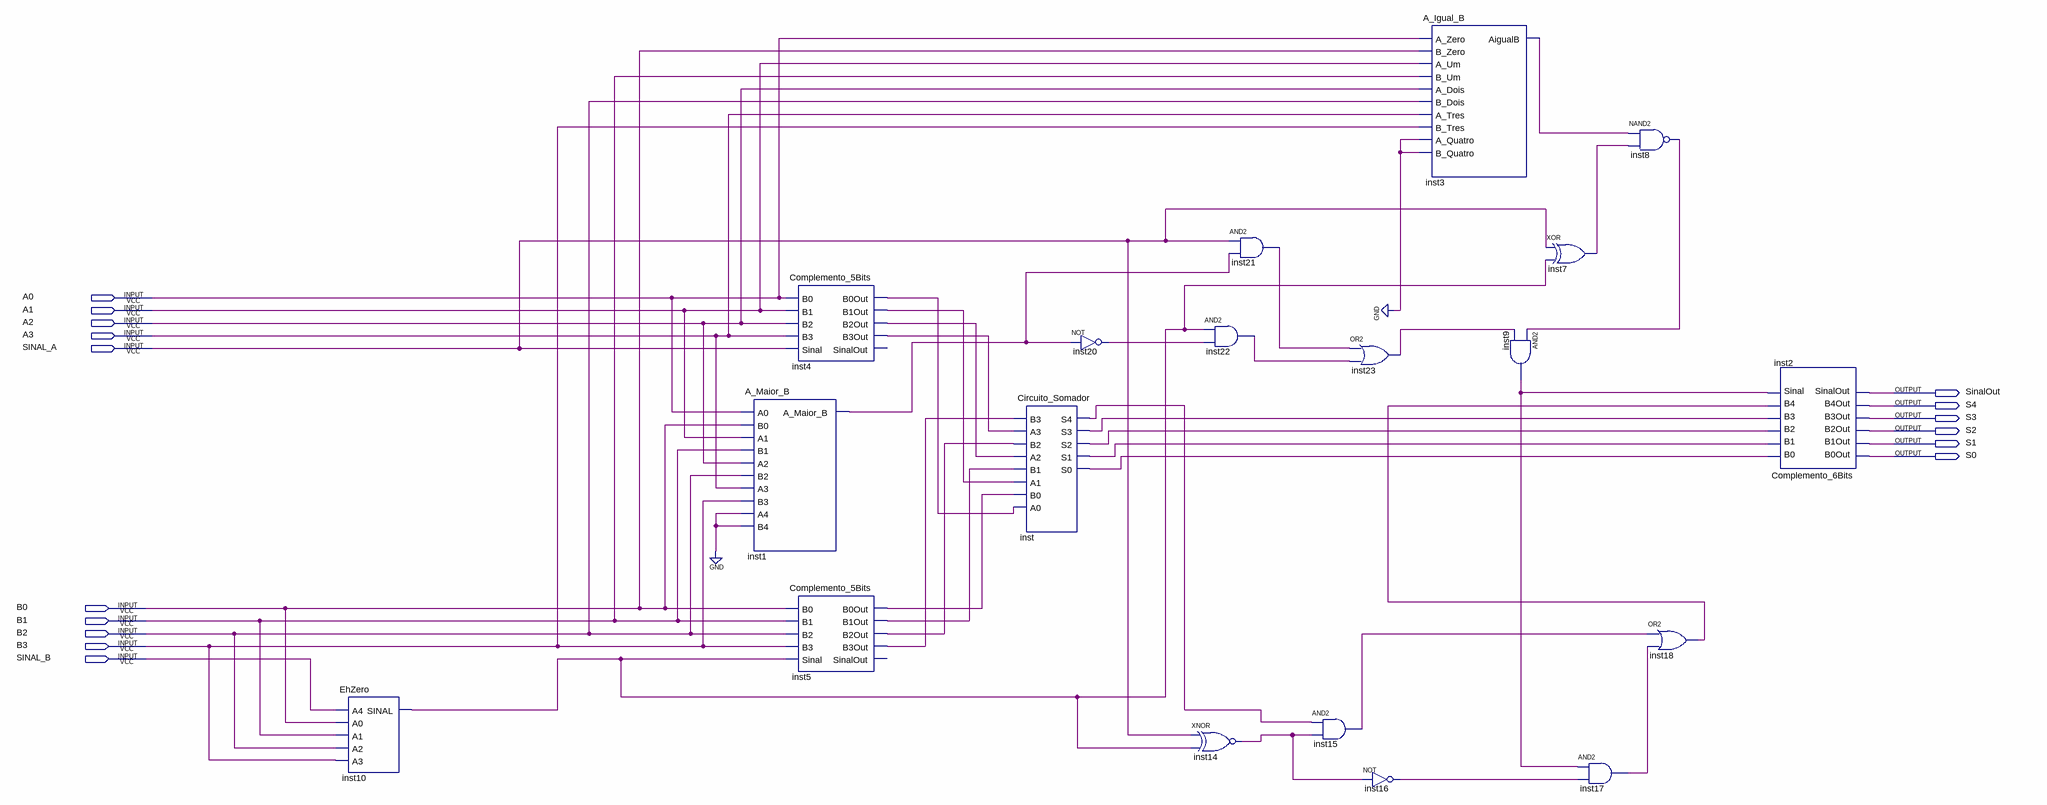
[diagram p0: schematic sheet]
// Quartus schematic A_Soma_B.bdf as structural Verilog: 19 symbols, 16 pins
module A_Soma_B (
  input  A0,
  input  A1,
  input  A2,
  input  A3,
  input  SINAL_A,
  input  B0,
  input  B1,
  input  B2,
  input  B3,
  input  SINAL_B,
  output SinalOut,
  output S4,
  output S3,
  output S2,
  output S1,
  output S0
);

  wire inst1_a_maior_b, inst3_aigualb, inst4_b0out, inst4_b1out, inst4_b2out, inst4_b3out, inst5_b0out,
       inst5_b1out, inst5_b2out, inst5_b3out, inst7_out, inst8_out, inst9_out, inst10_sinal, inst14_out,
       inst15_out, inst16_out, inst17_out, inst18_out, inst20_out, inst21_out, inst22_out, inst23_out,
       inst_s0, inst_s1, inst_s2, inst_s3, inst_s4;

  EhZero inst10 (.A4(SINAL_B), .A0(B0), .A1(B1), .A2(B2), .A3(B3), .SINAL(inst10_sinal));
  A_Maior_B inst1 (
    .A0(A0), .B0(B0), .A1(A1), .B1(B1), .A2(A2), .B2(B2), .A3(A3), .B3(B3), .A4(1'b0), .B4(1'b0),
    .A_Maior_B(inst1_a_maior_b));
  Complemento_5Bits inst4 (
    .B0(A0), .B1(A1), .B2(A2), .B3(A3), .Sinal(SINAL_A), .B0Out(inst4_b0out), .B1Out(inst4_b1out),
    .B2Out(inst4_b2out), .B3Out(inst4_b3out));  // open: SinalOut
  Complemento_5Bits inst5 (
    .B0(B0), .B1(B1), .B2(B2), .B3(B3), .Sinal(inst10_sinal), .B0Out(inst5_b0out), .B1Out(inst5_b1out),
    .B2Out(inst5_b2out), .B3Out(inst5_b3out));  // open: SinalOut
  Circuito_Somador inst (
    .B3(inst5_b3out), .A3(inst4_b3out), .B2(inst5_b2out), .A2(inst4_b2out), .B1(inst5_b1out),
    .A1(inst4_b1out), .B0(inst5_b0out), .A0(inst4_b0out), .S4(inst_s4), .S3(inst_s3), .S2(inst_s2),
    .S1(inst_s1), .S0(inst_s0));
  not inst20 (inst20_out, inst1_a_maior_b);
  xnor inst14 (inst14_out, SINAL_A, inst10_sinal);
  and inst21 (inst21_out, SINAL_A, inst1_a_maior_b);
  and inst22 (inst22_out, inst10_sinal, inst20_out);
  or inst23 (inst23_out, inst21_out, inst22_out);
  and inst15 (inst15_out, inst_s4, inst14_out);
  not inst16 (inst16_out, inst14_out);
  A_Igual_B inst3 (
    .A_Zero(A0), .B_Zero(B0), .A_Um(A1), .B_Um(B1), .A_Dois(A2), .B_Dois(B2), .A_Tres(A3), .B_Tres(B3),
    .A_Quatro(1'b0), .B_Quatro(1'b0), .AigualB(inst3_aigualb));
  and inst9 (inst9_out, inst8_out, inst23_out);
  xor inst7 (inst7_out, SINAL_A, inst10_sinal);
  and inst17 (inst17_out, inst9_out, inst16_out);
  nand inst8 (inst8_out, inst3_aigualb, inst7_out);
  or inst18 (inst18_out, inst15_out, inst17_out);
  Complemento_6Bits inst2 (
    .B0(inst_s0), .B1(inst_s1), .B2(inst_s2), .B3(inst_s3), .B4(inst18_out), .Sinal(inst9_out), .B0Out(S0),
    .B1Out(S1), .B2Out(S2), .B3Out(S3), .B4Out(S4), .SinalOut(SinalOut));
endmodule
